# EAGLE design in32 (EAGLE 6.5.0)
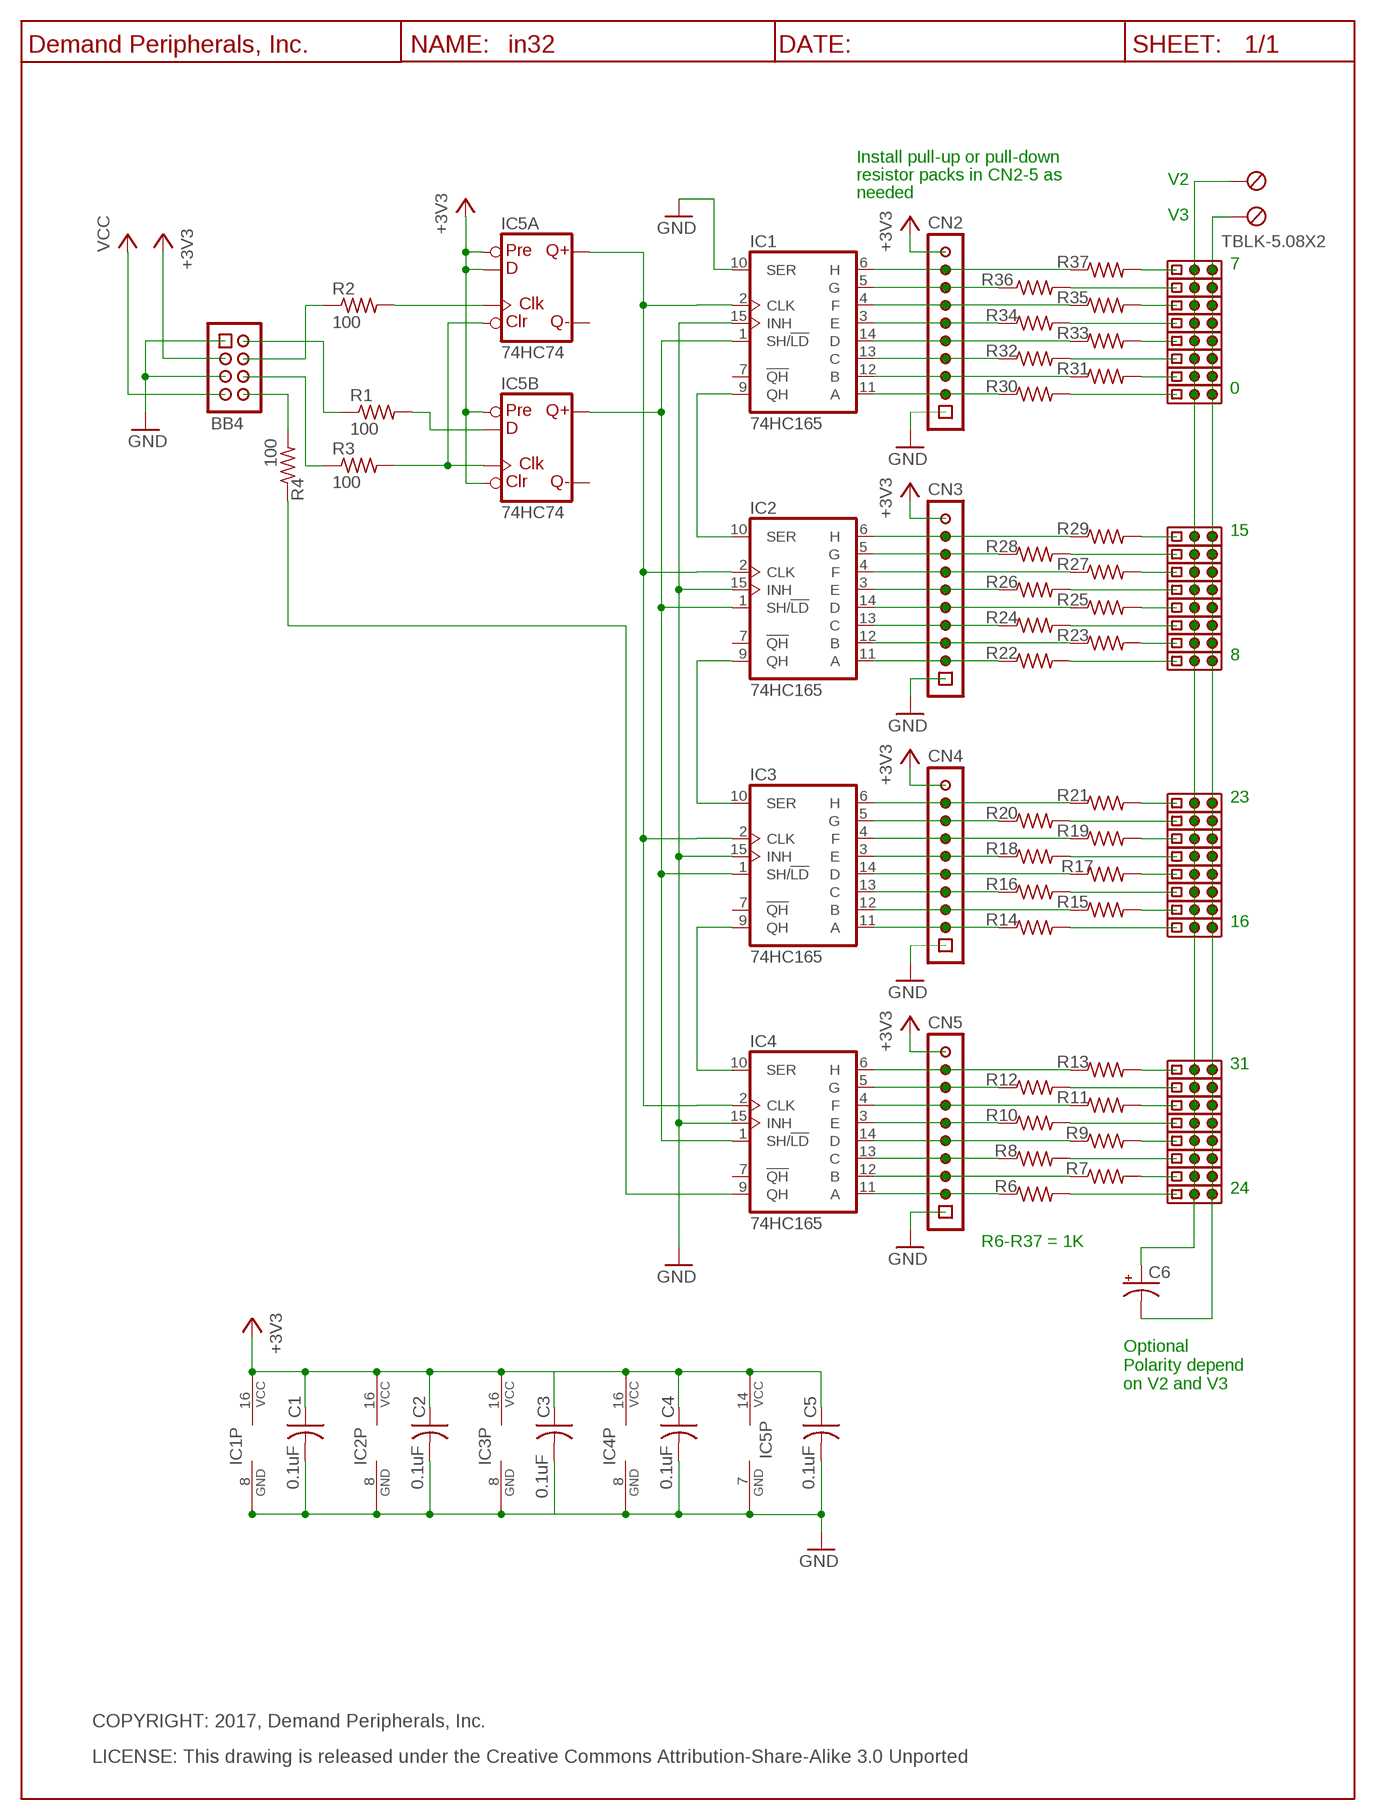
[diagram p0: schematic, sheet 1]

## Parts
BB4  Keyed_Pin_Header_4x2(0.1"x0.1")  HDR-4X2-SHR  [HDR-4X2]
C1  0.1uF  C0.1UF_C0603  [C0603]
C2  0.1uF  C0.1UF_C0603  [C0603]
C3  0.1uF  C0.1UF_C0603  [C0603]
C4  0.1uF  C0.1UF_C0603  [C0603]
C5  0.1uF  C0.1UF_C0603  [C0603]
C6  C100UF_E3.5-10  [E3.5-10]
CN1  TBLK-5.08X2  TBLK-5.08-X2  [TBLK-5.08-X2]
CN2  HDR-10X1  [HDR-10X1]
CN3  HDR-10X1  [HDR-10X1]
CN4  HDR-10X1  [HDR-10X1]
CN5  HDR-10X1  [HDR-10X1]
IC1  74HC165  [SO16]
IC2  74HC165  [SO16]
IC3  74HC165  [SO16]
IC4  74HC165  [SO16]
IC5  74HC74  74AHC74  [SO14]
R1  100  R100_R0603  [R0603]
R2  100  R100_R0603  [R0603]
R3  100  R100_R0603  [R0603]
R4  100  R100_R0603  [R0603]
R6  R1K_R0603  [R0603]
R7  R1K_R0603  [R0603]
R8  R1K_R0603  [R0603]
R9  R1K_R0603  [R0603]
R10  R1K_R0603  [R0603]
R11  R1K_R0603  [R0603]
R12  R1K_R0603  [R0603]
R13  R1K_R0603  [R0603]
R14  R1K_R0603  [R0603]
R15  R1K_R0603  [R0603]
R16  R1K_R0603  [R0603]
R17  R1K_R0603  [R0603]
R18  R1K_R0603  [R0603]
R19  R1K_R0603  [R0603]
R20  R1K_R0603  [R0603]
R21  R1K_R0603  [R0603]
R22  R1K_R0603  [R0603]
R23  R1K_R0603  [R0603]
R24  R1K_R0603  [R0603]
R25  R1K_R0603  [R0603]
R26  R1K_R0603  [R0603]
R27  R1K_R0603  [R0603]
R28  R1K_R0603  [R0603]
R29  R1K_R0603  [R0603]
R30  R1K_R0603  [R0603]
R31  R1K_R0603  [R0603]
R32  R1K_R0603  [R0603]
R33  R1K_R0603  [R0603]
R34  R1K_R0603  [R0603]
R35  R1K_R0603  [R0603]
R36  R1K_R0603  [R0603]
R37  R1K_R0603  [R0603]
U$2  DP_FRAME_P  [P_FRAME]
U$8  HDR-3X1  [HDR-3X1]
U$9  HDR-3X1  [HDR-3X1]
U$10  HDR-3X1  [HDR-3X1]
U$11  HDR-3X1  [HDR-3X1]
U$12  HDR-3X1  [HDR-3X1]
U$13  HDR-3X1  [HDR-3X1]
U$14  HDR-3X1  [HDR-3X1]
U$15  HDR-3X1  [HDR-3X1]
U$16  HDR-3X1  [HDR-3X1]
U$17  HDR-3X1  [HDR-3X1]
U$18  HDR-3X1  [HDR-3X1]
U$19  HDR-3X1  [HDR-3X1]
U$20  HDR-3X1  [HDR-3X1]
U$21  HDR-3X1  [HDR-3X1]
U$22  HDR-3X1  [HDR-3X1]
U$23  HDR-3X1  [HDR-3X1]
U$24  HDR-3X1  [HDR-3X1]
U$25  HDR-3X1  [HDR-3X1]
U$26  HDR-3X1  [HDR-3X1]
U$27  HDR-3X1  [HDR-3X1]
U$28  HDR-3X1  [HDR-3X1]
U$29  HDR-3X1  [HDR-3X1]
U$30  HDR-3X1  [HDR-3X1]
U$31  HDR-3X1  [HDR-3X1]
U$32  HDR-3X1  [HDR-3X1]
U$33  HDR-3X1  [HDR-3X1]
U$34  HDR-3X1  [HDR-3X1]
U$35  HDR-3X1  [HDR-3X1]
U$36  HDR-3X1  [HDR-3X1]
U$37  HDR-3X1  [HDR-3X1]
U$38  HDR-3X1  [HDR-3X1]
U$39  HDR-3X1  [HDR-3X1]

## Nets
+3V3: BB4.3 C1.1 C2.1 C3.1 C4.1 C5.1 CN2.10 CN3.10 CN4.10 CN5.10 IC1.16(VCC) IC2.16(VCC) IC3.16(VCC) IC4.16(VCC) IC5.2(A:D) IC5.4(A:PRE) IC5.10(B:PRE) IC5.13(B:CLR) IC5.14(P:VCC)
GND: BB4.1 BB4.5 C1.2 C2.2 C3.2 C4.2 C5.2 CN2.1 CN3.1 CN4.1 CN5.1 IC1.8(GND) IC1.10(SER) IC1.15(INH) IC2.8(GND) IC2.15(INH) IC3.8(GND) IC3.15(INH) IC4.8(GND) IC4.15(INH) IC5.7(P:GND)
N$1: BB4.8 R4.2
N$2: CN2.2 IC1.11(A) R30.1
N$3: IC1.9(QH) IC2.10(SER)
N$4: IC2.9(QH) IC3.10(SER)
N$7: CN2.3 IC1.12(B) R31.1
N$8: CN2.4 IC1.13(C) R32.1
N$9: CN2.5 IC1.14(D) R33.1
N$10: CN2.6 IC1.3(E) R34.1
N$12: CN2.7 IC1.4(F) R35.1
N$13: CN2.8 IC1.5(G) R36.1
N$14: CN2.9 IC1.6(H) R37.1
N$15: CN3.2 IC2.11(A) R22.1
N$16: CN3.3 IC2.12(B) R23.1
N$17: CN3.4 IC2.13(C) R24.1
N$18: CN3.5 IC2.14(D) R25.1
N$19: CN3.6 IC2.3(E) R26.1
N$20: CN3.7 IC2.4(F) R27.1
N$21: CN3.8 IC2.5(G) R28.1
N$22: CN3.9 IC2.6(H) R29.1
N$23: CN4.2 IC3.11(A) R14.1
N$24: CN4.3 IC3.12(B) R15.1
N$25: CN4.4 IC3.13(C) R16.1
N$26: CN4.5 IC3.14(D) R17.1
N$28: CN4.6 IC3.3(E) R18.1
N$29: CN4.7 IC3.4(F) R19.1
N$30: BB4.2 R1.1
N$31: CN4.8 IC3.5(G) R20.1
N$34: IC5.3(A:CLK) R2.2
N$35: IC3.9(QH) IC4.10(SER)
N$36: IC5.1(A:CLR) IC5.11(B:CLK) R3.2
N$37: CN4.9 IC3.6(H) R21.1
N$38: BB4.6 R3.1
N$39: IC1.2(CLK) IC2.2(CLK) IC3.2(CLK) IC4.2(CLK) IC5.5(A:Q)
N$41: BB4.4 R2.1
N$65: CN5.2 IC4.11(A) R6.1
N$66: IC4.9(QH) R4.1
N$67: CN5.3 IC4.12(B) R7.1
N$76: CN5.4 IC4.13(C) R8.1
N$98: CN5.5 IC4.14(D) R9.1
N$99: CN5.6 IC4.3(E) R10.1
N$100: CN5.7 IC4.4(F) R11.1
N$101: CN5.8 IC4.5(G) R12.1
N$102: CN5.9 IC4.6(H) R13.1
N$103: R31.2 U$14.1
N$107: R33.2 U$12.1
N$109: R35.2 U$10.1
N$110: IC5.12(B:D) R1.2
N$111: R37.2 U$8.1
N$112: R23.2 U$22.1
N$113: R25.2 U$20.1
N$114: R27.2 U$18.1
N$115: R29.2 U$16.1
N$116: R15.2 U$30.1
N$117: R17.2 U$28.1
N$118: R19.2 U$26.1
N$119: R21.2 U$24.1
N$120: R7.2 U$38.1
N$121: R9.2 U$36.1
N$122: R11.2 U$34.1
N$123: R13.2 U$32.1
N$124: R36.2 U$9.1
N$125: R34.2 U$11.1
N$126: IC1.1(SH/!LD) IC2.1(SH/!LD) IC3.1(SH/!LD) IC4.1(SH/!LD) IC5.9(B:Q)
N$127: R32.2 U$13.1
N$128: R30.2 U$15.1
N$129: R22.2 U$23.1
N$130: R24.2 U$21.1
N$131: R26.2 U$19.1
N$132: R28.2 U$17.1
N$133: R20.2 U$25.1
N$134: R18.2 U$27.1
N$135: R16.2 U$29.1
N$136: R14.2 U$31.1
N$137: R6.2 U$39.1
N$138: R8.2 U$37.1
N$139: R10.2 U$35.1
N$140: R12.2 U$33.1
V2: C6.+ CN1.1(KL) U$8.2 U$9.2 U$10.2 U$11.2 U$12.2 U$13.2 U$14.2 U$15.2 U$16.2 U$17.2 U$18.2 U$19.2 U$20.2 U$21.2 U$22.2 U$23.2 U$24.2 U$25.2 U$26.2 U$27.2 U$28.2 U$29.2 U$30.2 U$31.2 U$32.2 U$33.2 U$34.2 U$35.2 U$36.2 U$37.2 U$38.2 U$39.2
V3: C6.- CN1.2(KL1) U$8.3 U$9.3 U$10.3 U$11.3 U$12.3 U$13.3 U$14.3 U$15.3 U$16.3 U$17.3 U$18.3 U$19.3 U$20.3 U$21.3 U$22.3 U$23.3 U$24.3 U$25.3 U$26.3 U$27.3 U$28.3 U$29.3 U$30.3 U$31.3 U$32.3 U$33.3 U$34.3 U$35.3 U$36.3 U$37.3 U$38.3 U$39.3
VCC: BB4.7
Unconnected: IC1.7(!QH) IC2.7(!QH) IC3.7(!QH) IC4.7(!QH) IC5.6(A:!Q) IC5.8(B:!Q)

## Notes on the sheet
- Install pull-up or pull-down
- resistor packs in CN2-5 as | V2
- needed
- V3
- 7
- 0
- 15
- 8
- 23
- 16
- 31
- 24
- R6-R37 = 1K
- Optional
  Polarity depend
  on V2 and V3
- COPYRIGHT: 2017, Demand Peripherals, Inc.
- LICENSE: This drawing is released under the Creative Commons Attribution-Share-Alike 3.0 Unported

## Library data of the parts
BB4 = dpi-conn:HDR-4X2-SHR: Shrouded 4x2 pin header; VENDOR: Digikey; VENDOR-PART-NUM: 609-3530-ND
C1-C5 = dpi-passive:C0.1UF_: 0.1 uF Capacitor, 25V, X7R; VENDOR: Digikey; VENDOR-PART-NUM: 1276-1126-2-ND
C6 = dpi-passive:C100UF_: 100uF polarized capacitor, general purpose; VENDOR: Digikey
CN1 = dpi-conn:TBLK-5.08-X2: Terminal Block, 5.08mm, x2, screw terminals; VENDOR: Digikey; VENDOR-PART-NUM: ED2609-ND
CN2-CN5 = dpi-conn:HDR-10X1: Header 10X1
IC1-IC4 = dpi-transic:74HC165: NXP 74HC165 parallel-to-serial shift register; VENDOR: Digikey; VENDOR-PART-NUM: 568-1409-1-ND
IC5 = dpi-transic:74AHC74: Dual D type positive edge triggered FLIP FLOP, preset and clear; VENDOR: Digikey; VENDOR-PART-NUM: 568-4458-1-ND
R1-R4 = dpi-passive:R100_: 100 Ohm resistor, 1%, 0.1 watt; VENDOR: Digikey; VENDOR-PART-NUM: 311-100HRTR-ND
R6-R37 = dpi-passive:R1K_: 1K Resistor, 1%, 0.1 watt; VENDOR: Digikey; VENDOR-PART-NUM: 311-1.00KHRTR-ND
U$2 = dpi-sym:DP_FRAME_P: Portrait/Letter Document Frame
U$8-U$39 = dpi-conn:HDR-3X1: 3 pin header on 0.1 inch centers, no shroud, no lock; VENDOR: Digikey; VENDOR-PART-NUM: 952-2264-ND

## Board
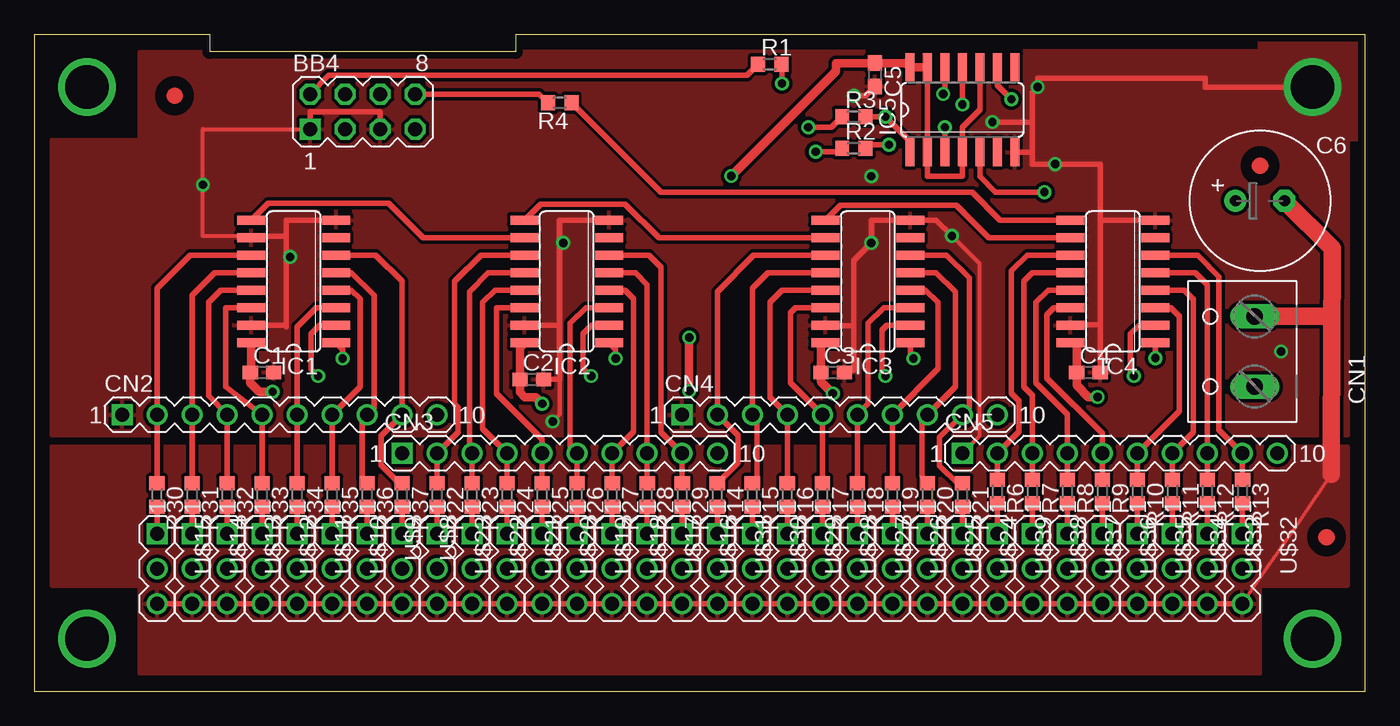
[diagram p1: board, top side]
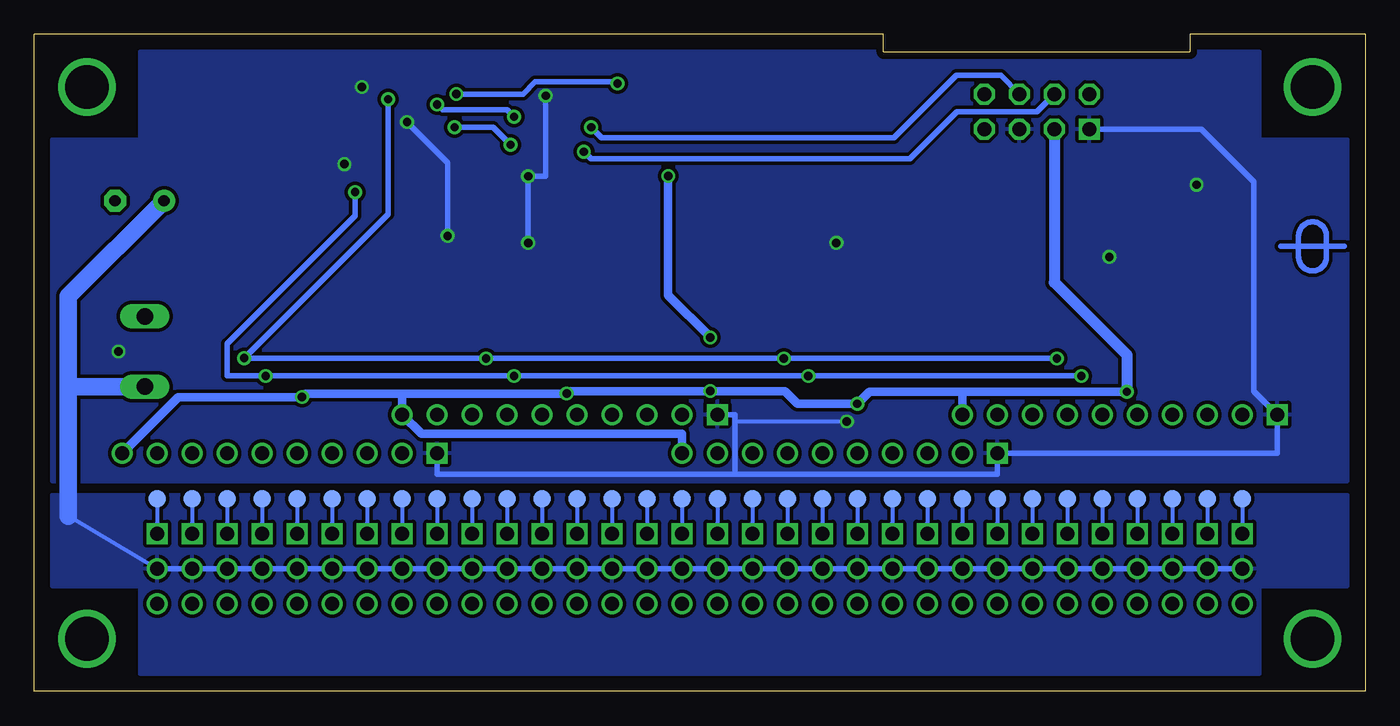
[diagram p2: board, bottom side, seen from below]

Size 96.52 x 47.62 mm. Coordinates in mm from the lower left corner, seen from the top.
Outline: 0,0 96.52,0 96.52,47.62 34.92,47.62 34.92,46.35 12.7,46.35 12.7,47.62 0,47.62 0,0
Copper layers (1*16): Top 0.035mm / dielectric 1.5mm / Bottom 0.035mm
Design rules "default *": minimum track width 10mil, minimum drill 20mil, track to track 10mil, track to pad 10mil, pad to pad 10mil, via to via 10mil, smd to smd 10mil, copper to edge 20mil, drill to drill 12mil, minimum pad ring 10mil, minimum via ring 8mil, stop-mask expansion 4mil, vias tented up to drill 0mil, thermal gap 10mil

### Footprints (pad centres in the part's own frame; a part is rotated, then mirrored left to right if it is on the bottom)
HDR-4X2 = drill 1.016 square: 1 -3.81,-1.27 | drill 1.016 octagon: 2 -3.81,1.27; 3 -1.27,-1.27; 4 -1.27,1.27; 5 1.27,-1.27; 6 1.27,1.27; 7 3.81,-1.27; 8 3.81,1.27
C0603 = smd 1.1 x 1: 1 -0.85,0; 2 0.85,0
E3.5-10 = drill 0.813 pad 1.6: + -1.778,0 | drill 0.813 pad 1.6 octagon: - 1.778,0
TBLK-5.08-X2 = drill 1.194 long: 1 -2.54,-0.127; 2 2.54,-0.127
HDR-10X1 = drill 1.016 square: 1 0,-11.43 | drill 1.016: 2 0,-8.89; 3 0,-6.35; 4 0,-3.81; 5 0,-1.27; 6 0,1.27; 7 0,3.81; 8 0,6.35; 9 0,8.89; 10 0,11.43
TEST-POINT = smd 1.27 x 1.27: P1 0,0
SO16 = smd 0.66 x 2.032: 1 -4.445,-3.073; 2 -3.175,-3.073; 3 -1.905,-3.073; 4 -0.635,-3.073; 5 0.635,-3.073; 6 1.905,-3.073; 7 3.175,-3.073; 8 4.445,-3.073; 9 4.445,3.073; 10 3.175,3.073; 11 1.905,3.073; 12 0.635,3.073; 13 -0.635,3.073; 14 -1.905,3.073; 15 -3.175,3.073; 16 -4.445,3.073
SO14 = smd 0.66 x 2.032: 1 -3.81,-3.073; 2 -2.54,-3.073; 3 -1.27,-3.073; 4 0,-3.073; 5 1.27,-3.073; 6 2.54,-3.073; 7 3.81,-3.073; 8 3.81,3.073; 9 2.54,3.073; 10 1.27,3.073; 11 0,3.073; 12 -1.27,3.073; 13 -2.54,3.073; 14 -3.81,3.073
R0603 = smd 1 x 1.1: 1 -0.85,0; 2 0.85,0
HDR-3X1 = drill 1.016 square: 1 -2.54,0 | drill 1.016: 2 0,0; 3 2.54,0

### Placement (x,y rotation side)
BB4  23.81,42.04 0 top
C1  16.51,23.11 0 top
C2  36.07,22.61 0 top
C3  57.91,23.11 0 top
C4  76.45,23.11 0 top
C5  60.96,44.7 270 top
C6  88.9,35.56 0 top
CN1  88.39,24.64 90 top
CN2  17.78,20.07 270 top
CN3  38.1,17.27 270 top
CN4  58.42,20.07 270 top
CN5  78.74,17.27 270 top
E$1  [TEST-POINT]  8.89,13.97 0 bottom
E$2  [TEST-POINT]  11.43,13.97 0 bottom
E$3  [TEST-POINT]  13.97,13.97 0 bottom
E$4  [TEST-POINT]  16.51,13.97 0 bottom
E$5  [TEST-POINT]  19.05,13.97 0 bottom
E$7  [TEST-POINT]  21.59,13.97 0 bottom
E$8  [TEST-POINT]  24.13,13.97 0 bottom
E$9  [TEST-POINT]  26.67,13.97 0 bottom
E$10  [TEST-POINT]  29.21,13.97 0 bottom
E$11  [TEST-POINT]  31.75,13.97 0 bottom
E$12  [TEST-POINT]  34.29,13.97 0 bottom
E$13  [TEST-POINT]  36.83,13.97 0 bottom
E$14  [TEST-POINT]  39.37,13.97 0 bottom
E$15  [TEST-POINT]  41.91,13.97 0 bottom
E$16  [TEST-POINT]  44.45,13.97 0 bottom
E$17  [TEST-POINT]  46.99,13.97 0 bottom
E$18  [TEST-POINT]  49.53,13.97 0 bottom
E$19  [TEST-POINT]  52.07,13.97 0 bottom
E$20  [TEST-POINT]  54.61,13.97 0 bottom
E$21  [TEST-POINT]  57.15,13.97 0 bottom
E$22  [TEST-POINT]  59.69,13.97 0 bottom
E$23  [TEST-POINT]  62.23,13.97 0 bottom
E$24  [TEST-POINT]  64.77,13.97 0 bottom
E$25  [P_FRAME]  0,0 0 top
E$26  [TEST-POINT]  67.31,13.97 0 bottom
E$27  [TEST-POINT]  69.85,13.97 0 bottom
E$28  [TEST-POINT]  72.39,13.97 0 bottom
E$29  [TEST-POINT]  74.93,13.97 0 bottom
E$30  [TEST-POINT]  77.47,13.97 0 bottom
E$31  [TEST-POINT]  80.01,13.97 0 bottom
E$32  [TEST-POINT]  82.55,13.97 0 bottom
E$33  [TEST-POINT]  85.09,13.97 0 bottom
E$34  [TEST-POINT]  87.63,13.97 0 bottom
IC1  18.8,29.72 90 top
IC2  38.61,29.72 90 top
IC3  60.45,29.72 90 top
IC4  78.23,29.72 90 top
IC5  67.31,42.16 0 top
R1  53.34,45.47 0 top
R2  59.44,39.37 0 top
R3  59.44,41.66 0 top
R4  38.1,42.67 180 top
R6  69.85,14.48 270 top
R7  72.39,14.48 270 top
R8  74.93,14.48 270 top
R9  77.47,14.48 270 top
R10  80.01,14.48 270 top
R11  82.55,14.48 270 top
R12  85.09,14.48 270 top
R13  87.63,14.48 270 top
R14  49.53,14.22 270 top
R15  52.07,14.22 270 top
R16  54.61,14.22 270 top
R17  57.15,14.22 270 top
R18  59.69,14.22 270 top
R19  62.23,14.22 270 top
R20  64.77,14.22 270 top
R21  67.31,14.22 270 top
R22  29.21,14.22 270 top
R23  31.75,14.22 270 top
R24  34.29,14.22 270 top
R25  36.83,14.22 270 top
R26  39.37,14.22 270 top
R27  41.91,14.22 270 top
R28  44.45,14.22 270 top
R29  46.99,14.22 270 top
R30  8.89,14.22 270 top
R31  11.43,14.22 270 top
R32  13.97,14.22 270 top
R33  16.51,14.22 270 top
R34  19.05,14.22 270 top
R35  21.59,14.22 270 top
R36  24.13,14.22 270 top
R37  26.67,14.22 270 top
U$1  [P_FRAME]  0,0 0 top
U$2  -2.54,-2.54 0 top
U$4  [FIDUCIAL]  93.73,11.18 270 top
U$5  [FIDUCIAL]  88.9,38.1 0 top
U$6  [FIDUCIAL]  10.16,43.18 0 top
U$7  [DPI-1]  3.81,32.26 90 bottom
U$8  26.67,8.89 270 top
U$9  24.13,8.89 270 top
U$10  21.59,8.89 270 top
U$11  19.05,8.89 270 top
U$12  16.51,8.89 270 top
U$13  13.97,8.89 270 top
U$14  11.43,8.89 270 top
U$15  8.89,8.89 270 top
U$16  46.99,8.89 270 top
U$17  44.45,8.89 270 top
U$18  41.91,8.89 270 top
U$19  39.37,8.89 270 top
U$20  36.83,8.89 270 top
U$21  34.29,8.89 270 top
U$22  31.75,8.89 270 top
U$23  29.21,8.89 270 top
U$24  67.31,8.89 270 top
U$25  64.77,8.89 270 top
U$26  62.23,8.89 270 top
U$27  59.69,8.89 270 top
U$28  57.15,8.89 270 top
U$29  54.61,8.89 270 top
U$30  52.07,8.89 270 top
U$31  49.53,8.89 270 top
U$32  87.63,8.89 270 top
U$33  85.09,8.89 270 top
U$34  82.55,8.89 270 top
U$35  80.01,8.89 270 top
U$36  77.47,8.89 270 top
U$37  74.93,8.89 270 top
U$38  72.39,8.89 270 top
U$39  69.85,8.89 270 top

### Tracks (layer width: path | path; a pad name or v marks a point on that pad's centre or on a via)
+3V3  (via drill 0.6)
  Top 0.406: IC5.10 68.58,42.16 67.31,40.89 IC5.4 67.31,37.34 65.02,37.34 64.77,37.34 IC5.2 IC5.13
  Top 0.61: IC5.13 IC5.14 63.18,45.55 C5.1 58.15,45.55 58.15,44.97 v50.55,37.36 | IC2.16 35.22,24.96 C2.1 35.22,21.68 35.56,21.34 36.35,21.34 v36.83,20.85 | IC3.16 57.06,25.27 C3.1 57.06,22.44 v57.91,21.59 | IC4.16 75.6,25.27 C4.1 75.6,22.19 76.45,21.34 v77.11,21.34 | v17.27,21.72 16.31,21.72 15.67,22.35 15.66,22.36 C1.1 15.72,23.18 IC1.16 | v47.5,25.65 v47.5,21.77
  Bottom 0.61: CN3.10 49.53,18.67 49.99,18.67 68.45,18.67 CN4.10 69.85,21.59 | 29.36,21.72 35.97,21.72 v36.83,20.85 41.17,20.85 42.09,21.77 v47.5,21.77 57.73,21.77 v57.91,21.59 69.85,21.59 | 29.36,21.72 v17.27,21.72 | CN2.10 29.21,21.72 29.36,21.72 | 69.85,21.59 76.86,21.59 v77.11,21.34 86.11,21.34 CN5.10 | v50.55,37.36 50.55,28.7 v47.5,25.65
  Bottom 0.813: BB4.3 22.54,29.65 17.27,24.38 v17.27,21.72
GND  (via drill 0.6, 3.17 pad 3.17)
  Top 0.305: CN5.1 68.58,18.54 68.58,20.32 68.58,30.99 v66.55,33.02 | 38.08,22.61 38.08,20.04 v37.59,19.56 | 15.72,32.99 12.22,32.99 v12.22,36.73 12.22,40.77 BB4.1
  Top 0.406: C5.2 60.29,43.18 v59.44,43.18 | BB4.5 25.08,42.04 23.82,42.04 20,42.04 BB4.1 | IC5.7 72.39,39.09 | 72.39,39.09 72.39,38.23 v74.04,38.23 77.3,38.23 77.3,33.83 | v92.71,43.81 84.94,43.81 84.94,43.89 84.94,44.45 72.77,44.45 v72.77,43.81 72.39,43.43 72.39,41.2 | 72.39,39.09 72.39,41.2 | C2.2 38.08,22.61 38.08,26.54 | 38.08,26.54 38.08,33.53 38.08,34.16 IC2.8 | IC2.15 38.08,26.54 | 18.26,32.99 18.26,26.42 18.26,26.54 IC1.15 | 18.26,32.99 18.26,33.3 18.26,34.16 IC1.8 | IC1.10 15.72,32.99 18.26,32.99 | C3.2 59.44,23.28 59.44,26.52 | IC3.15 57.38,26.52 59.44,26.52 | C4.2 77.3,26.59 | 77.3,26.59 77.3,33.83 | 77.3,33.83 77.3,34.16 IC4.8 | IC4.15 75.16,26.59 77.3,26.59 | 59.44,26.52 59.44,31.24 v60.71,32.51 60.71,34.16 IC3.8 65.41,34.16 v66.55,33.02 | v69.49,41.27 72.31,41.27 72.39,41.2
  Bottom 0.305: v37.59,19.56 45.57,19.56 45.72,19.41
  Bottom 0.406: v59.44,43.18 59.44,37.34 v60.71,37.34 v60.71,32.51 | BB4.1 11.86,40.77 8.05,36.96 8.05,21.77 CN2.1 6.35,17.27 CN3.1 26.67,15.75 45.72,15.75 | 45.72,15.75 45.72,19.41 45.72,20.07 CN4.1 | CN5.1 67.31,15.75 45.72,15.75 | v66.55,33.02 66.55,38.33 v69.49,41.27
  other vias: 90.42,24.64 18.54,31.5 38.35,32.51
  pour Top: 1.27,18.54 1.27,40.01 7.62,40.01 7.62,46.35 88.9,46.48 88.9,47.12 96.01,47.12 96.01,40.01 95.25,40.01 95.25,18.54
  pour Bottom: 1.27,15.24 1.27,40.01 7.62,40.01 7.62,46.35 88.9,46.35 88.9,40.01 95.25,40.01 95.25,15.24
MOUNT0  (via drill 3.17 pad 3.17)
  other vias: 3.81,43.81
MOUNT6  (via drill 3.17 pad 3.17)
  other vias: 92.71,3.81
N$1
  Top 0.406: BB4.8 36.62,43.31 R4.2
N$2
  Top 0.406: R30.1 CN2.2 8.89,29.21 11.3,31.62 IC1.11
N$3
  Top 0.406: IC1.9 16.94,35.38 25.7,35.38 28.19,32.89 IC2.10
N$4
  Top 0.406: IC2.9 36.7,35.33 42.85,35.33 45.29,32.89 IC3.10
N$7
  Top 0.406: R31.1 CN2.3 11.43,28.7 13.08,30.35 IC1.12
N$8
  Top 0.406: R32.1 CN2.4 | 13.72,20.32 CN2.4 | IC1.13 13.51,29.08 12.62,28.19 12.62,21.41 CN2.4
N$9
  Top 0.406: R33.1 CN2.5 13.87,22.07 13.87,27.81 IC1.14
N$10
  Top 0.406: R34.1 CN2.6 19.05,26.42 20.45,27.81 IC1.3
N$12
  Top 0.406: R35.1 CN2.7 23.62,22.1 23.62,28.45 22.99,29.08 IC1.4
N$13
  Top 0.406: R36.1 23.77,15.43 23.77,18.16 23.77,19.71 CN2.8 24.64,20.57 24.64,28.7 22.99,30.35 IC1.5
N$14
  Top 0.406: R37.1 26.45,15.07 25.15,16.38 25.15,18.54 CN2.9 26.67,29.72 24.77,31.62 IC1.6
N$15
  Top 0.406: R22.1 CN3.2 30.73,18.8 30.73,20.57 30.48,20.83 30.48,29.72 32.38,31.62 IC2.11
N$16
  Top 0.406: R23.1 CN3.3 31.57,17.55 31.57,28.98 32.89,30.35 IC2.12
N$17
  Top 0.406: R24.1 CN3.4 32.51,19.05 32.51,28.19 33.4,29.08 IC2.13
N$18
  Top 0.406: R25.1 CN3.5 36.83,18.29 33.53,21.59 33.53,27.81 IC2.14
N$19
  Top 0.406: R26.1 CN3.6 38.86,17.78 38.86,26.67 40.01,27.81 IC2.3
N$20
  Top 0.406: 42.04,17.4 CN3.7 | R27.1 CN3.7 | IC2.4 42.82,29.08 43.46,28.45 43.46,18.82 CN3.7
N$21
  Top 0.406: R28.1 CN3.8 44.45,29.49 43.59,30.35 IC2.5
N$22
  Top 0.406: R29.1 CN3.9 45.47,18.8 45.47,30.73 44.58,31.62 IC2.6
N$23
  Top 0.406: R14.1 51.03,16.57 51.03,17.91 51.03,18.57 CN4.2 49.53,28.98 52.17,31.62 IC3.11
N$24
  Top 0.406: R15.1 52.43,15.43 52.43,18.82 52.43,19.71 CN4.3 52.07,29.21 53.21,30.35 IC3.12
N$25
  Top 0.406: R16.1 CN4.4 53.34,21.34 53.34,28.19 54.23,29.08 IC3.13
N$26
  Top 0.406: R17.1 CN4.5 54.84,22.38 54.84,27.46 55.19,27.81 IC3.14
N$28
  Top 0.406: IC3.3 61.62,27.81 60.48,26.67 60.48,20.85 CN4.6 R18.1
N$29
  Top 0.406: R19.1 CN4.7 65.53,23.37 65.53,28.19 64.64,29.08 IC3.4
N$30
  Top 0.406: BB4.2 21.35,44.65 29.64,44.65 51.68,44.65 R1.1
N$31
  Top 0.406: R20.1 arc-59 64.39,15.75 64.39,19.68 CN4.8 66.8,22.1 66.8,28.96 65.41,30.35 IC3.5
N$32
  Bottom 0.305: 11.43,13.46 11.43,12.19
N$34  (via drill 0.6)
  Top 0.406: IC5.3 66.04,41.15 v66.04,40.89 | R2.2 60.54,39.62 v61.98,39.62
  Bottom 0.406: v66.04,40.89 63.25,40.89 v61.98,39.62
N$35
  Top 0.406: IC3.9 58.47,35.26 66.88,35.23 69.24,32.87 IC4.10
N$36  (via drill 0.6)
  Top 0.406: R3.2 v61.72,41.66 63.5,39.88 IC5.1 | v67.31,42.55 IC5.11
  Bottom 0.406: v67.31,42.55 66.93,42.16 62.99,42.16 62.23,42.16 v61.72,41.66
N$37
  Top 0.406: R21.1 66.94,15.07 65.66,16.36 65.66,18.41 CN4.9 67.82,20.57 67.82,29.97 66.17,31.62 IC3.6
N$38  (via drill 0.6)
  Top 0.406: R3.1 57.82,40.89 v56.13,40.89
  Bottom 0.406: BB4.6 26.43,44.65 29.64,44.65 34.16,40.13 55.37,40.13 v56.13,40.89
N$39  (via drill 0.6)
  Top 0.406: IC1.2 20.7,26.54 20.07,25.91 20.07,23.34 v20.57,22.86 | v40.39,22.86 39.78,23.37 39.78,25.91 40.41,26.54 IC2.2 | IC3.2 61.85,26.54 61.47,26.16 61.47,23.24 v61.72,22.86 | IC4.2 80.14,26.54 79.5,25.91 79.5,23.14 v79.76,22.86 | v73.25,36.2 69.72,36.2 68.58,37.34 IC5.5
  Bottom 0.406: v20.57,22.86 v40.39,22.86 v61.72,22.86 v79.76,22.86 82.55,22.86 82.55,25.2 73.25,34.49 v73.25,36.2
N$41  (via drill 0.6)
  Top 0.406: R2.1 58.33,39.12 v56.67,39.12
  Bottom 0.406: BB4.4 23.81,42.04 29.59,42.04 33.02,38.61 56.16,38.61 v56.67,39.12
N$42
  Bottom 0.305: 13.97,13.46 13.97,12.19
N$56
  Bottom 0.305: 16.51,13.46 16.51,12.19
N$61
  Bottom 0.305: 19.05,13.46 19.05,12.19
N$65
  Top 0.406: R6.1 CN5.2 71.4,18.82 71.4,21.08 70.87,21.61 70.87,30.48 72.01,31.62 IC4.11
N$66
  Top 0.406: R4.1 45.45,36.17 68.02,36.17 70.03,34.16 IC4.9
N$67
  Top 0.406: R7.1 CN5.3 72.39,21.46 71.75,22.1 71.75,29.72 72.39,30.35 IC4.12
N$72
  Bottom 0.305: 21.59,13.46 21.59,12.19
N$74
  Bottom 0.305: 24.13,13.46 24.13,12.19
N$76
  Top 0.406: R8.1 CN5.4 74.93,20.09 72.64,22.38 72.64,28.19 73.53,29.08 IC4.13
N$77
  Bottom 0.305: 26.67,13.46 26.67,12.19
N$78
  Bottom 0.305: 29.21,13.46 29.21,12.19
N$79
  Bottom 0.305: 31.75,13.46 31.75,12.19
N$80
  Bottom 0.305: 34.29,13.46 34.29,12.19
N$81
  Bottom 0.305: 36.83,13.46 36.83,12.19
N$82
  Bottom 0.305: 39.37,13.46 39.37,12.19
N$83
  Bottom 0.305: 41.91,13.46 41.91,12.19
N$84
  Bottom 0.305: 44.45,13.46 44.45,12.19
N$85
  Bottom 0.305: 49.53,13.46 49.53,12.19
N$86
  Bottom 0.305: 52.07,13.46 52.07,12.19
N$87
  Bottom 0.305: 54.61,13.46 54.61,12.19
N$88
  Bottom 0.305: 57.15,13.46 57.15,12.19
N$89
  Bottom 0.305: 59.69,13.46 59.69,12.19
N$90
  Bottom 0.305: 62.23,13.46 62.23,12.19
N$91
  Bottom 0.305: 64.77,13.46 64.77,12.19
N$92
  Bottom 0.305: 67.31,13.46 67.31,12.19
N$93
  Bottom 0.305: 69.85,13.46 69.85,12.19
N$94
  Bottom 0.305: 72.39,13.46 72.39,12.19
N$95
  Bottom 0.305: 74.93,13.46 74.93,12.19
N$96
  Bottom 0.305: 77.47,13.46 77.47,12.19
N$97
  Bottom 0.305: 80.01,13.46 80.01,12.19
N$98
  Top 0.406: R9.1 CN5.5 77.47,18.69 73.46,22.71 73.46,27.3 73.97,27.81 IC4.14
N$99
  Top 0.406: R10.1 CN5.6 83.06,20.32 83.06,27.18 82.42,27.81 IC4.3
N$100
  Top 0.406: R11.1 CN5.7 84.07,18.8 84.07,28.42 83.41,29.08 IC4.4
N$101
  Top 0.406: R12.1 CN5.8 85.09,29.49 84.23,30.35 IC4.5
N$102
  Top 0.406: R13.1 CN5.9 85.93,18.97 85.93,30.07 84.38,31.62 IC4.6
N$103
  Top 0.406: U$14.1 R31.2
N$104
  Bottom 0.305: 82.55,13.46 82.55,12.19
N$105
  Bottom 0.305: 85.09,13.46 85.09,12.19
N$106
  Bottom 0.305: 46.99,13.46 46.99,12.19
N$107
  Top 0.406: U$12.1 R33.2
N$108  (via drill 3.17 pad 3.17)
  other vias: 3.81,3.81
N$109
  Top 0.406: U$10.1 R35.2
N$110  (via drill 0.6)
  Top 0.406: IC5.12 66.04,43.43 v65.91,43.31 | v54.23,44.07 54.23,45.43 R1.2
  Bottom 0.406: v65.91,43.31 61.09,43.31 60.2,44.2 54.36,44.2 v54.23,44.07
N$111
  Top 0.406: U$8.1 R37.2
N$112
  Top 0.406: U$22.1 R23.2
N$113
  Top 0.406: R25.2 U$20.1
N$114
  Top 0.406: R27.2 U$18.1
N$115
  Top 0.406: R29.2 U$16.1
N$116
  Top 0.406: R15.2 U$30.1
N$117
  Top 0.406: U$28.1 R17.2
N$118
  Top 0.406: U$26.1 R19.2
N$119
  Top 0.406: U$24.1 R21.2
N$120
  Top 0.406: U$38.1 R7.2
N$121
  Top 0.406: U$36.1 R9.2
N$122
  Top 0.406: U$34.1 R11.2
N$123
  Top 0.406: R13.2 U$32.1
N$124
  Top 0.406: U$9.1 R36.2
N$125
  Top 0.406: U$11.1 R34.2
N$126  (via drill 0.6)
  Top 0.406: IC4.1 v81.31,24.16 | v63.75,24.13 63.52,24.46 IC3.1 | IC2.1 42.16,24.79 v42.16,24.13 | IC1.1 22.35,24.79 v22.35,24.13 | IC5.9 69.85,43.94 v70.87,42.93
  Bottom 0.406: v22.35,24.13 v42.16,24.13 v63.75,24.13 63.78,24.16 v81.31,24.16 70.87,34.59 v70.87,42.93
N$127
  Top 0.406: U$13.1 R32.2
N$128
  Top 0.406: U$15.1 R30.2
N$129
  Top 0.406: U$23.1 R22.2
N$130
  Top 0.406: R24.2 U$21.1
N$131
  Top 0.406: R26.2 U$19.1
N$132
  Top 0.406: R28.2 U$17.1
N$133
  Top 0.406: U$25.1 R20.2
N$134
  Top 0.406: U$27.1 R18.2
N$135
  Top 0.406: U$29.1 R16.2
N$136
  Top 0.406: R14.2 U$31.1
N$137
  Top 0.406: U$39.1 R6.2
N$138
  Top 0.406: U$37.1 R8.2
N$139
  Top 0.406: U$35.1 R10.2
N$140
  Top 0.406: U$33.1 R12.2
S$1
  Bottom 0.305: 8.89,13.46 8.89,12.19
S$2
  Bottom 0.305: 87.63,13.46 87.63,12.19
V2
  Bottom 0.254: 94.06,12.7 93.73,12.5 U$32.2
  Bottom 0.406: U$15.2 U$14.2 U$13.2 U$12.2 U$11.2 U$10.2 U$9.2 U$8.2 U$23.2 U$22.2 U$21.2 U$20.2 U$19.2 U$18.2 U$17.2 U$16.2 U$31.2 U$30.2 U$29.2 U$28.2 U$27.2 U$26.2 U$25.2 U$24.2 U$39.2 U$38.2 U$37.2 U$36.2 U$35.2 U$34.2 U$33.2 U$32.2
  Bottom 1.27: 94.06,22.07 94.06,24.64 94.06,28.63 C6.+ | 94.06,22.07 94.06,12.7 | CN1.1 94.03,22.1 94.06,22.07
  pour Bottom: 1.27,7.62 1.27,14.22 95.25,14.22 95.25,7.62 88.9,7.62 88.9,1.27 7.62,1.27 7.62,7.62
V3
  Top 0.254: 94.06,15.72 91.24,11.58 88.82,8.13 U$32.3
  Top 0.406: U$32.3 U$33.3 U$34.3 U$35.3 U$36.3 U$37.3 U$38.3 U$39.3 U$24.3 U$25.3 U$26.3 U$27.3 U$28.3 U$29.3 U$30.3 U$31.3 U$16.3 U$17.3 U$18.3 U$19.3 U$20.3 U$21.3 U$22.3 U$23.3 U$8.3 U$9.3 U$10.3 U$11.3 U$12.3 U$13.3 U$14.3 U$15.3
  Top 1.27: 94.12,27.13 94.13,29.72 94.13,32.11 C6.- | 94.12,27.13 94.06,15.72 | CN1.2 94.07,27.18 94.12,27.13
  pour Top: 1.27,7.62 1.27,17.78 95.25,17.78 95.25,7.62 88.9,7.62 88.9,1.27 7.62,1.27 7.62,7.62

### Text on the board
tTest: 3.8 Inches | 3.5 Inches | BB4 | R1 | C5 | R4 | IC5 | R3 | (C) 2018, Demand Peripherals, Inc. | IN32, Rev 18A | R2 | V2 | V3 | Optional | V3 | C1 | IC1 | C3 | C4 | C2 | IC2 | IC3 | IC4 | V2 | 3.3 | Gnd | 3.3 | Gnd | Gnd | 3.3 | Gnd | 3.3 | 1.575 Inches | 1.875 Inches | 1 | 1 | 2 | 2 | 3 | 3 | 0 | 4 | 8 | 12 | 16 | 20 | 24 | 28 | 31